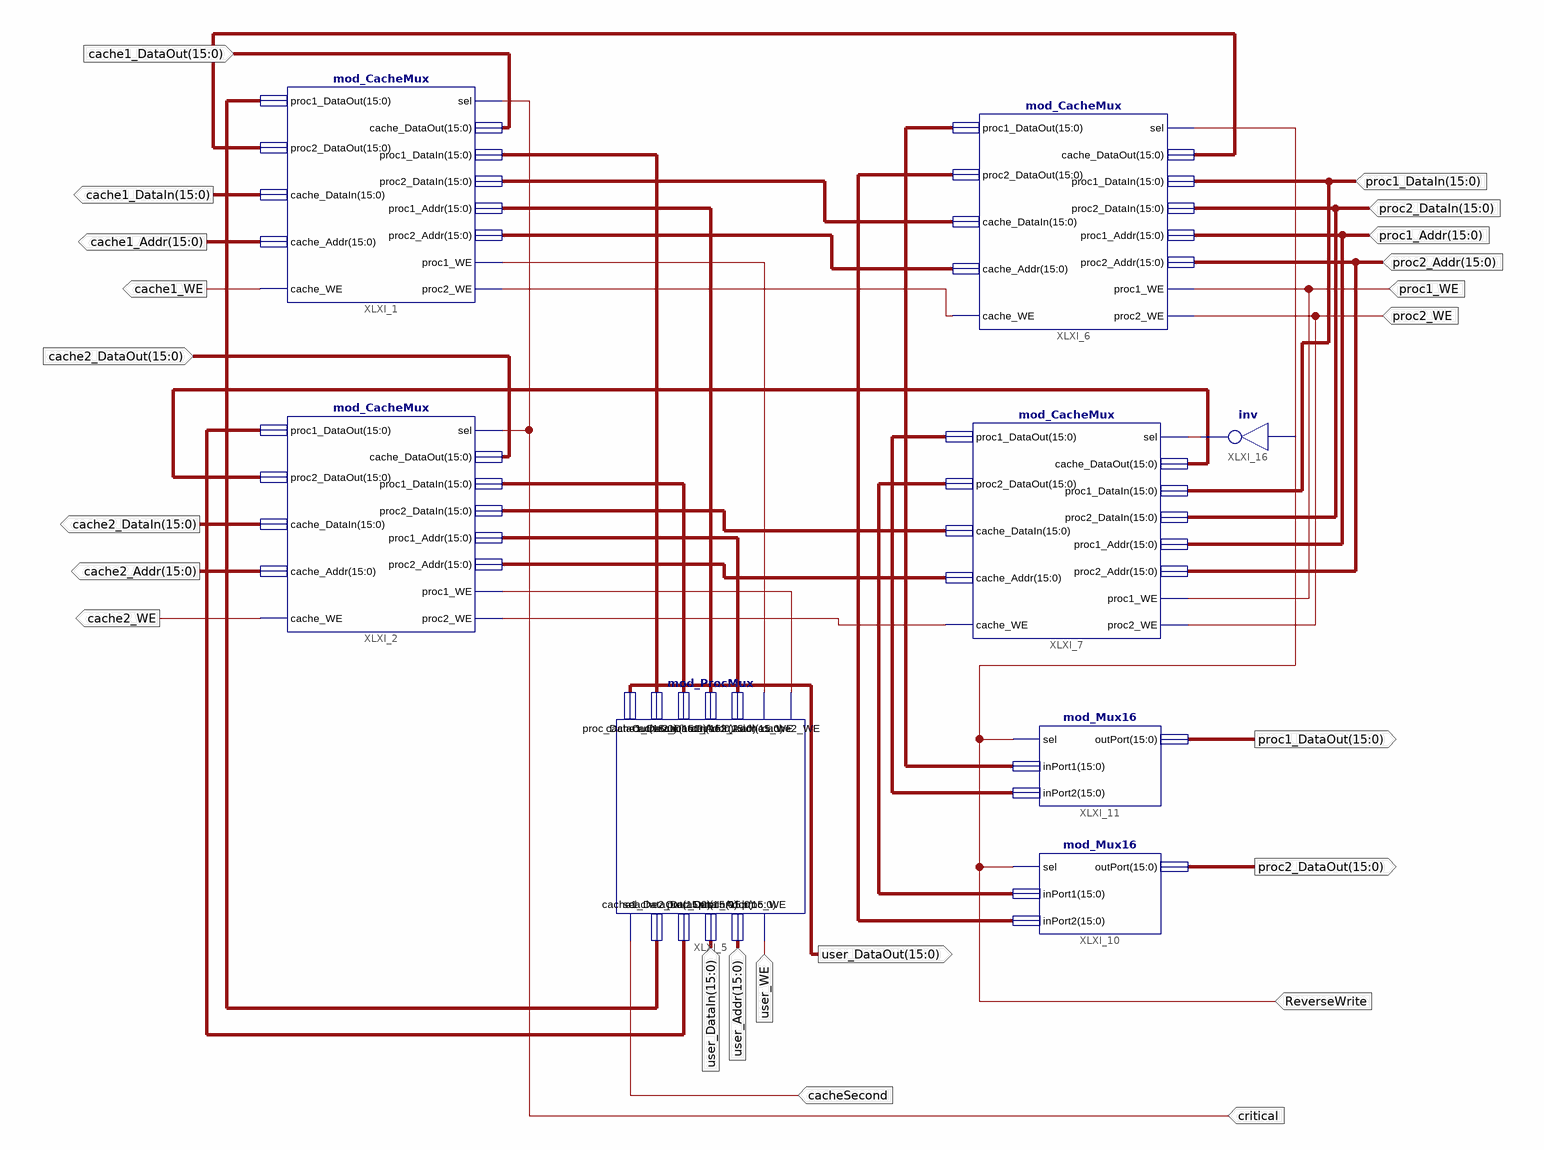
[diagram p0: schematic sheet 1]
// Xilinx ISE schematic mod_LayerRouter.sch (spartan3e) as structural Verilog: 8 symbols, 23 ports
module mod_LayerRouter (
  input  [15:0] cache2_DataOut,
  input  [15:0] cache1_DataOut,
  input  critical,
  input  ReverseWrite,
  input  [15:0] user_DataIn,
  input  [15:0] user_Addr,
  input  user_WE,
  input  [15:0] proc1_Addr,
  input  [15:0] proc2_Addr,
  input  [15:0] proc1_DataIn,
  input  [15:0] proc2_DataIn,
  input  proc1_WE,
  input  proc2_WE,
  input  cacheSecond,
  output [15:0] user_DataOut,
  output [15:0] proc1_DataOut,
  output [15:0] proc2_DataOut,
  output [15:0] cache1_DataIn,
  output [15:0] cache1_Addr,
  output cache1_WE,
  output [15:0] cache2_DataIn,
  output [15:0] cache2_Addr,
  output cache2_WE
);

  wire XLXN_26, XLXN_29, XLXN_41, XLXN_42, XLXN_80;
  wire [15:0] XLXN_5, XLXN_7, XLXN_16, XLXN_17, XLXN_18, XLXN_19, XLXN_25, XLXN_30, XLXN_31, XLXN_34,
       XLXN_35, XLXN_37, XLXN_38, XLXN_39, XLXN_40, XLXN_74;

  mod_CacheMux XLXI_1 (
    .sel(critical), .cache_DataOut(cache1_DataOut), .proc1_DataIn(XLXN_37), .proc2_DataIn(XLXN_31),
    .proc1_Addr(XLXN_39), .proc2_Addr(XLXN_30), .proc1_WE(XLXN_41), .proc2_WE(XLXN_29),
    .proc1_DataOut(XLXN_7), .proc2_DataOut(XLXN_5), .cache_DataIn(cache1_DataIn), .cache_Addr(cache1_Addr),
    .cache_WE(cache1_WE));
  mod_CacheMux XLXI_2 (
    .sel(critical), .cache_DataOut(cache2_DataOut), .proc1_DataIn(XLXN_38), .proc2_DataIn(XLXN_35),
    .proc1_Addr(XLXN_40), .proc2_Addr(XLXN_34), .proc1_WE(XLXN_42), .proc2_WE(XLXN_26),
    .proc1_DataOut(XLXN_25), .proc2_DataOut(XLXN_74), .cache_DataIn(cache2_DataIn), .cache_Addr(cache2_Addr),
    .cache_WE(cache2_WE));
  mod_ProcMux XLXI_5 (
    .sel(cacheSecond), .cache1_DataOut(XLXN_7), .cache2_DataOut(XLXN_25), .proc_DataIn(user_DataIn),
    .proc_Addr(user_Addr), .proc_WE(user_WE), .proc_DataOut(user_DataOut), .cache1_DataIn(XLXN_37),
    .cache2_DataIn(XLXN_38), .cache1_Addr(XLXN_39), .cache2_Addr(XLXN_40), .cache1_WE(XLXN_41),
    .cache2_WE(XLXN_42));
  mod_CacheMux XLXI_6 (
    .sel(ReverseWrite), .cache_DataOut(XLXN_5), .proc1_DataIn(proc1_DataIn), .proc2_DataIn(proc2_DataIn),
    .proc1_Addr(proc1_Addr), .proc2_Addr(proc2_Addr), .proc1_WE(proc1_WE), .proc2_WE(proc2_WE),
    .proc1_DataOut(XLXN_19), .proc2_DataOut(XLXN_16), .cache_DataIn(XLXN_31), .cache_Addr(XLXN_30),
    .cache_WE(XLXN_29));
  mod_CacheMux XLXI_7 (
    .sel(XLXN_80), .cache_DataOut(XLXN_74), .proc1_DataIn(proc1_DataIn), .proc2_DataIn(proc2_DataIn),
    .proc1_Addr(proc1_Addr), .proc2_Addr(proc2_Addr), .proc1_WE(proc1_WE), .proc2_WE(proc2_WE),
    .proc1_DataOut(XLXN_18), .proc2_DataOut(XLXN_17), .cache_DataIn(XLXN_35), .cache_Addr(XLXN_34),
    .cache_WE(XLXN_26));
  mod_Mux16 XLXI_10 (.sel(ReverseWrite), .inPort1(XLXN_17), .inPort2(XLXN_16), .outPort(proc2_DataOut));
  mod_Mux16 XLXI_11 (.sel(ReverseWrite), .inPort1(XLXN_19), .inPort2(XLXN_18), .outPort(proc1_DataOut));
  not XLXI_16 (XLXN_80, ReverseWrite);
endmodule
